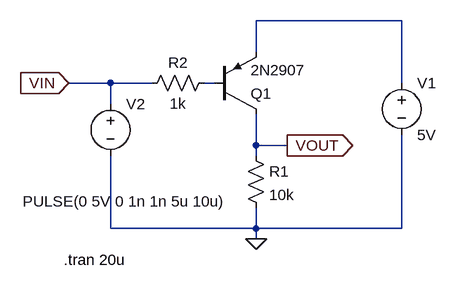
[diagram p0: schematic PNP_test.asc]
PNP_test.asc, the LTspice schematic file:
Version 4
SHEET 1 880 680
WIRE 240 64 16 64
WIRE 16 112 16 64
WIRE -208 160 -272 160
WIRE -144 160 -208 160
WIRE -48 160 -64 160
WIRE 240 160 240 64
WIRE -208 192 -208 160
WIRE 16 256 16 208
WIRE 64 256 16 256
WIRE 16 272 16 256
WIRE -208 384 -208 272
WIRE 16 384 16 352
WIRE 16 384 -208 384
WIRE 240 384 240 240
WIRE 240 384 16 384
WIRE 16 400 16 384
FLAG 16 400 0
FLAG -272 160 VIN
IOPIN -272 160 In
FLAG 64 256 VOUT
IOPIN 64 256 Out
SYMBOL res 0 256 R0
SYMATTR InstName R1
SYMATTR Value 10k
SYMBOL voltage 240 144 R0
WINDOW 123 0 0 Left 0
WINDOW 39 0 0 Left 0
SYMATTR InstName V1
SYMATTR Value 5V
SYMBOL voltage -208 176 R0
WINDOW 123 0 0 Left 0
WINDOW 39 0 0 Left 0
WINDOW 3 -135 166 Left 0
SYMATTR Value PULSE(0 5V 0 1n 1n 5u 10u)
SYMATTR InstName V2
SYMBOL res -48 144 R90
WINDOW 0 0 56 VBottom 0
WINDOW 3 32 56 VTop 0
SYMATTR InstName R2
SYMATTR Value 1k
SYMBOL pnp -48 208 M180
SYMATTR InstName Q1
SYMATTR Value 2N2907
TEXT -280 432 Left 0 !.tran 20u

The netlist it stands for:
* PNP_test.asc
R1 VOUT 0 10k
V1 N001 0 5V
V2 VIN 0 PULSE(0 5V 0 1n 1n 5u 10u)
R2 N002 VIN 1k
Q1 VOUT N002 N001 0 2N2907
.model NPN NPN
.model PNP PNP
.lib standard.bjt
.tran 20u
.backanno
.end